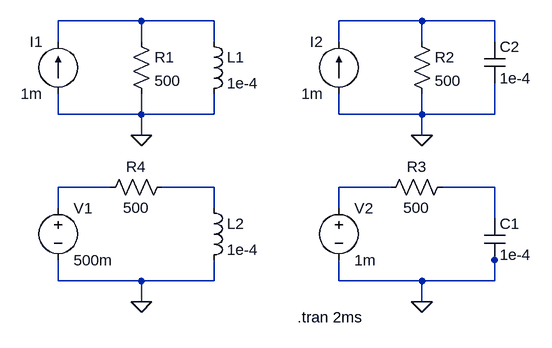
[diagram p0: schematic Draft4.asc]
Draft4.asc, the LTspice schematic file:
Version 4.1
SHEET 1 956 680
WIRE 336 -64 208 -64
WIRE 448 -64 336 -64
WIRE 768 -64 640 -64
WIRE 880 -64 768 -64
WIRE 208 -32 208 -64
WIRE 336 -32 336 -64
WIRE 448 -32 448 -64
WIRE 640 -32 640 -64
WIRE 768 -32 768 -64
WIRE 880 -32 880 -64
WIRE 208 80 208 48
WIRE 336 80 336 48
WIRE 336 80 208 80
WIRE 448 80 448 48
WIRE 448 80 336 80
WIRE 640 80 640 48
WIRE 768 80 768 48
WIRE 768 80 640 80
WIRE 880 80 880 32
WIRE 880 80 768 80
WIRE 336 112 336 80
WIRE 768 112 768 80
WIRE 288 192 208 192
WIRE 448 192 368 192
WIRE 720 192 640 192
WIRE 880 192 800 192
WIRE 208 224 208 192
WIRE 448 224 448 192
WIRE 640 224 640 192
WIRE 880 240 880 192
WIRE 880 304 880 288
WIRE 208 336 208 304
WIRE 336 336 208 336
WIRE 448 336 448 304
WIRE 448 336 336 336
WIRE 640 336 640 304
WIRE 768 336 640 336
WIRE 880 336 880 304
WIRE 880 336 768 336
WIRE 336 368 336 336
WIRE 768 368 768 336
FLAG 336 112 0
FLAG 336 368 0
FLAG 768 112 0
FLAG 768 368 0
SYMBOL ind 432 -48 R0
SYMATTR InstName L1
SYMATTR Value 1e-4
SYMBOL res 320 -48 R0
SYMATTR InstName R1
SYMATTR Value 500
SYMBOL current 208 48 R180
WINDOW 0 24 80 Left 2
WINDOW 3 24 0 Left 2
WINDOW 123 0 0 Left 0
WINDOW 39 0 0 Left 0
SYMATTR InstName I1
SYMATTR Value 1m
SYMBOL ind 432 208 R0
SYMATTR InstName L2
SYMATTR Value 1e-4
SYMBOL res 384 176 R90
WINDOW 0 0 56 VBottom 2
WINDOW 3 32 56 VTop 2
SYMATTR InstName R4
SYMATTR Value 500
SYMBOL voltage 208 208 R0
WINDOW 123 0 0 Left 0
WINDOW 39 0 0 Left 0
SYMATTR InstName V1
SYMATTR Value 500m
SYMBOL res 752 -48 R0
SYMATTR InstName R2
SYMATTR Value 500
SYMBOL current 640 48 R180
WINDOW 0 24 80 Left 2
WINDOW 3 24 0 Left 2
WINDOW 123 0 0 Left 0
WINDOW 39 0 0 Left 0
SYMATTR InstName I2
SYMATTR Value 1m
SYMBOL res 816 176 R90
WINDOW 0 0 56 VBottom 2
WINDOW 3 32 56 VTop 2
SYMATTR InstName R3
SYMATTR Value 500
SYMBOL voltage 640 208 R0
WINDOW 123 0 0 Left 0
WINDOW 39 0 0 Left 0
SYMATTR InstName V2
SYMATTR Value 1m
SYMBOL cap 864 240 R0
SYMATTR InstName C1
SYMATTR Value 1e-4
SYMBOL cap 864 -32 R0
SYMATTR InstName C2
SYMATTR Value 1e-4
TEXT 576 392 Left 2 !.tran 2ms

The netlist it stands for:
* Draft4.asc
L1 N001 0 1e-4
R1 N001 0 500
I1 0 N001 1m
L2 N004 0 1e-4
R4 N004 N003 500
V1 N003 0 500m
R2 N002 0 500
I2 0 N002 1m
R3 N006 N005 500
V2 N005 0 1m
C1 N006 0 1e-4
C2 N002 0 1e-4
.tran 2ms
.backanno
.end